# EAGLE schematic main_rev1 (EAGLE 7.1.0)
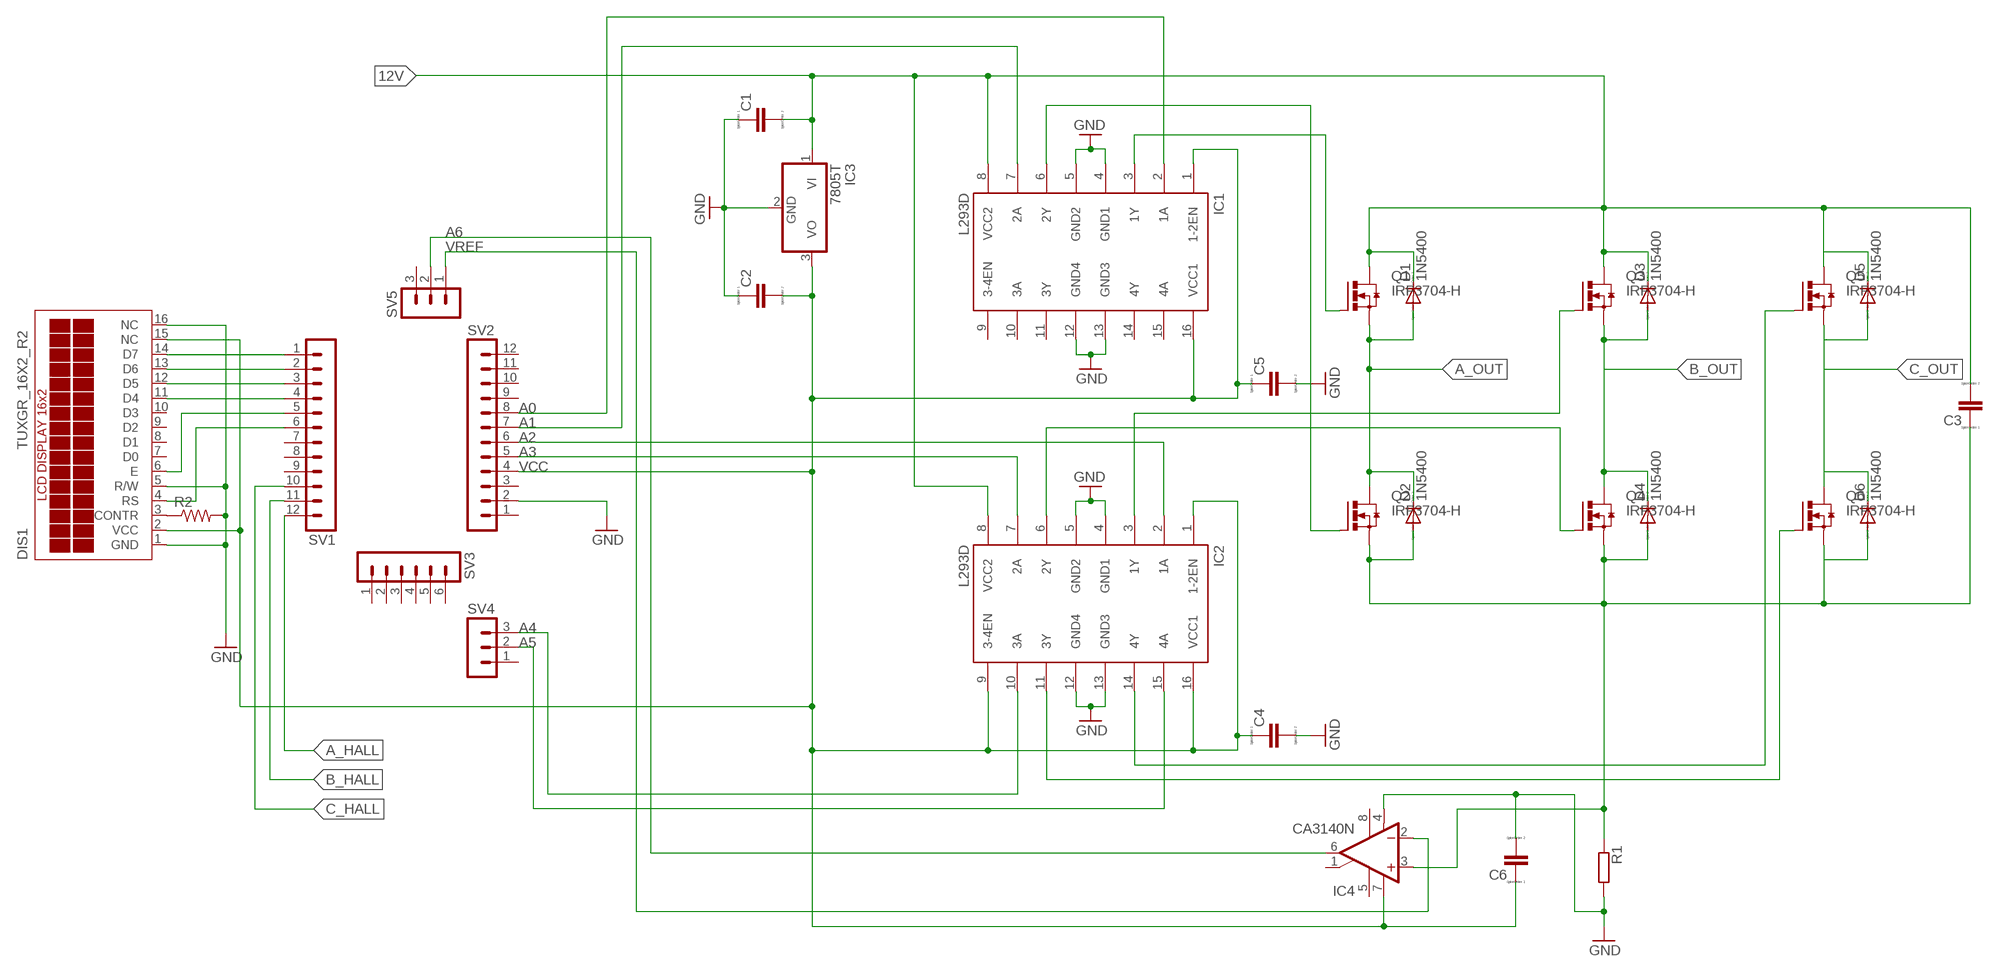
[diagram p0: schematic, sheet 1]

## Parts
C1  C-EU025_050-025X075  [C025_050-025X075]
C2  C-EU025_050-025X075  [C025_050-025X075]
C3  C-EU025_050-025X075  [C025_050-025X075]
C4  C-EU025_050-025X075  [C025_050-025X075]
C5  C-EU025_050-025X075  [C025_050-025X075]
C6  C-EU025_050-025X075  [C025_050-025X075]
D1  1N5400  [DO201-15]
D2  1N5400  [DO201-15]
D3  1N5400  [DO201-15]
D4  1N5400  [DO201-15]
D5  1N5400  [DO201-15]
D6  1N5400  [DO201-15]
DIS1  TUXGR_16X2_R2  [TUXGR_16X2_R2]
IC1  L293D  [DIL16]
IC2  L293D  [DIL16]
IC3  7805T  [TO220H]
IC4  CA3140N  [DIL08]
Q1  IRF3704-H  [TO220BH]
Q2  IRF3704-H  [TO220BH]
Q3  IRF3704-H  [TO220BH]
Q4  IRF3704-H  [TO220BH]
Q5  IRF3704-H  [TO220BH]
Q6  IRF3704-H  [TO220BH]
R1  PMD  [PMD]
R2  R-US_0204/5  [0204/5]
SV1  MA12-1  [MA12-1]
SV2  MA12-1  [MA12-1]
SV3  MA06-1  [MA06-1]
SV4  MA03-1  [MA03-1]
SV5  MA03-1  [MA03-1]

## Nets
12V: C1.2 C3.2 D1.C D3.C IC1.8(VCC2) IC2.8(VCC2) IC3.1(VI) Q1.D Q3.D Q5.D
A0: IC1.2(1A) SV2.8
A1: IC1.7(2A) SV2.7
A2: IC2.2(1A) SV2.6
A3: IC2.7(2A) SV2.5
A4: IC2.10(3A) SV4.3
A5: IC2.15(4A) SV4.2
A6: IC4.6(OUT) SV5.2
A_HALL: SV1.12
A_OUT: D1.A D2.C Q1.S Q2.D
B_HALL: SV1.11
C_HALL: SV1.10
GND: C1.1 C2.1 C4.2 C5.2 C6.2 DIS1.1(GND) DIS1.5(R/W) DIS1.16(NC) IC1.4(GND1) IC1.5(GND2) IC1.12(GND4) IC1.13(GND3) IC2.4(GND1) IC2.5(GND2) IC2.12(GND4) IC2.13(GND3) IC3.2(GND) IC4.4(V-) R1.1 R2.2 SV2.2
N$2: IC1.3(1Y) Q1.G
N$4: D3.A D4.C Q3.S Q4.D
N$5: Q5.S Q6.D
N$6: IC1.6(2Y) Q2.G
N$7: IC2.3(1Y) Q3.G
N$8: IC2.11(3Y) Q6.G
N$9: IC2.6(2Y) Q4.G
N$10: IC2.14(4Y) Q5.G
N$13: D5.A
N$14: D5.C
N$15: D6.A
N$16: D6.C
N$18: C3.1 D2.A D4.A IC4.3(+IN) Q2.S Q4.S Q6.S R1.2
N$19: DIS1.3(CONTR) R2.1
N$20: DIS1.14(D7) SV1.1
N$21: DIS1.13(D6) SV1.2
N$22: DIS1.12(D5) SV1.3
N$23: DIS1.11(D4) SV1.4
N$24: DIS1.6(E) SV1.5
N$25: DIS1.4(RS) SV1.6
VCC: C2.2 C4.1 C5.1 C6.1 DIS1.2(VCC) DIS1.15(NC) IC1.1(1-2EN) IC1.16(VCC1) IC2.1(1-2EN) IC2.9(3-4EN) IC2.16(VCC1) IC3.3(VO) IC4.7(V+) SV2.4
VREF: IC4.2(-IN) SV5.1
Unconnected: DIS1.7(D0) DIS1.8(D1) DIS1.9(D2) DIS1.10(D3) IC1.9(3-4EN) IC1.10(3A) IC1.11(3Y) IC1.14(4Y) IC1.15(4A) IC4.1(ON/CMP) IC4.5(ON) IC4.8(CMP) SV1.7 SV1.8 SV1.9 SV2.1 SV2.3 SV2.9 SV2.10 SV2.11 SV2.12 SV3.1 SV3.2 SV3.3 SV3.4 SV3.5 SV3.6 SV4.1 SV5.3

## Library data of the parts
C1-C6 = resistor:C-EU: CAPACITOR, European symbol; SPICEPREFIX: C
D1-D6 = diode:1N5400: DIODE standard rectifier, 3 A, 50 V (Motorola)
DIS1 = display-lcd:TUXGR_16X2_R2: Tuxgraphics LCD display 16x2 characters reflective, without background light Source: tuxgr_12x2_r2.pdf; OC_FARNELL: unknown; OC_NEWARK: unknown
IC1 IC2 = st-microelectronics:L293D: PUSH-PULL 4 CHANNEL DRIVER; MPN: L293D; OC_FARNELL: 9589619; OC_NEWARK: 56P8249
IC3 = linear:78*: Positive VOLTAGE REGULATOR Source: http://cache.national.com/ds/LM/LM78L05.pdf http://www.fairchildsemi.com/ds/LM/LM7805.pdf
IC4 = linear:CA3140: OP AMP
Q1-Q6 = transistor-power:IRF3704: SMPS MOSFET HEXFET® Power MOSFET Source: http://www.irf.com/product-info/datasheets/data/irf3704.pdf
R1 = resistor-shunt:PMD: SMD SHUNT RESISTOR; OC_FARNELL: unknown; OC_NEWARK: unknown
R2 = rcl:R-US_: RESISTOR, American symbol
SV1 SV2 = con-lstb:MA12-1: PIN HEADER; OC_FARNELL: unknown; OC_NEWARK: unknown
SV3 = con-lstb:MA06-1: PIN HEADER; OC_FARNELL: unknown; OC_NEWARK: unknown
SV4 SV5 = con-lstb:MA03-1: PIN HEADER; OC_FARNELL: unknown; OC_NEWARK: unknown